# EAGLE design solar_mains_charge_manager (EAGLE 8.4.1)
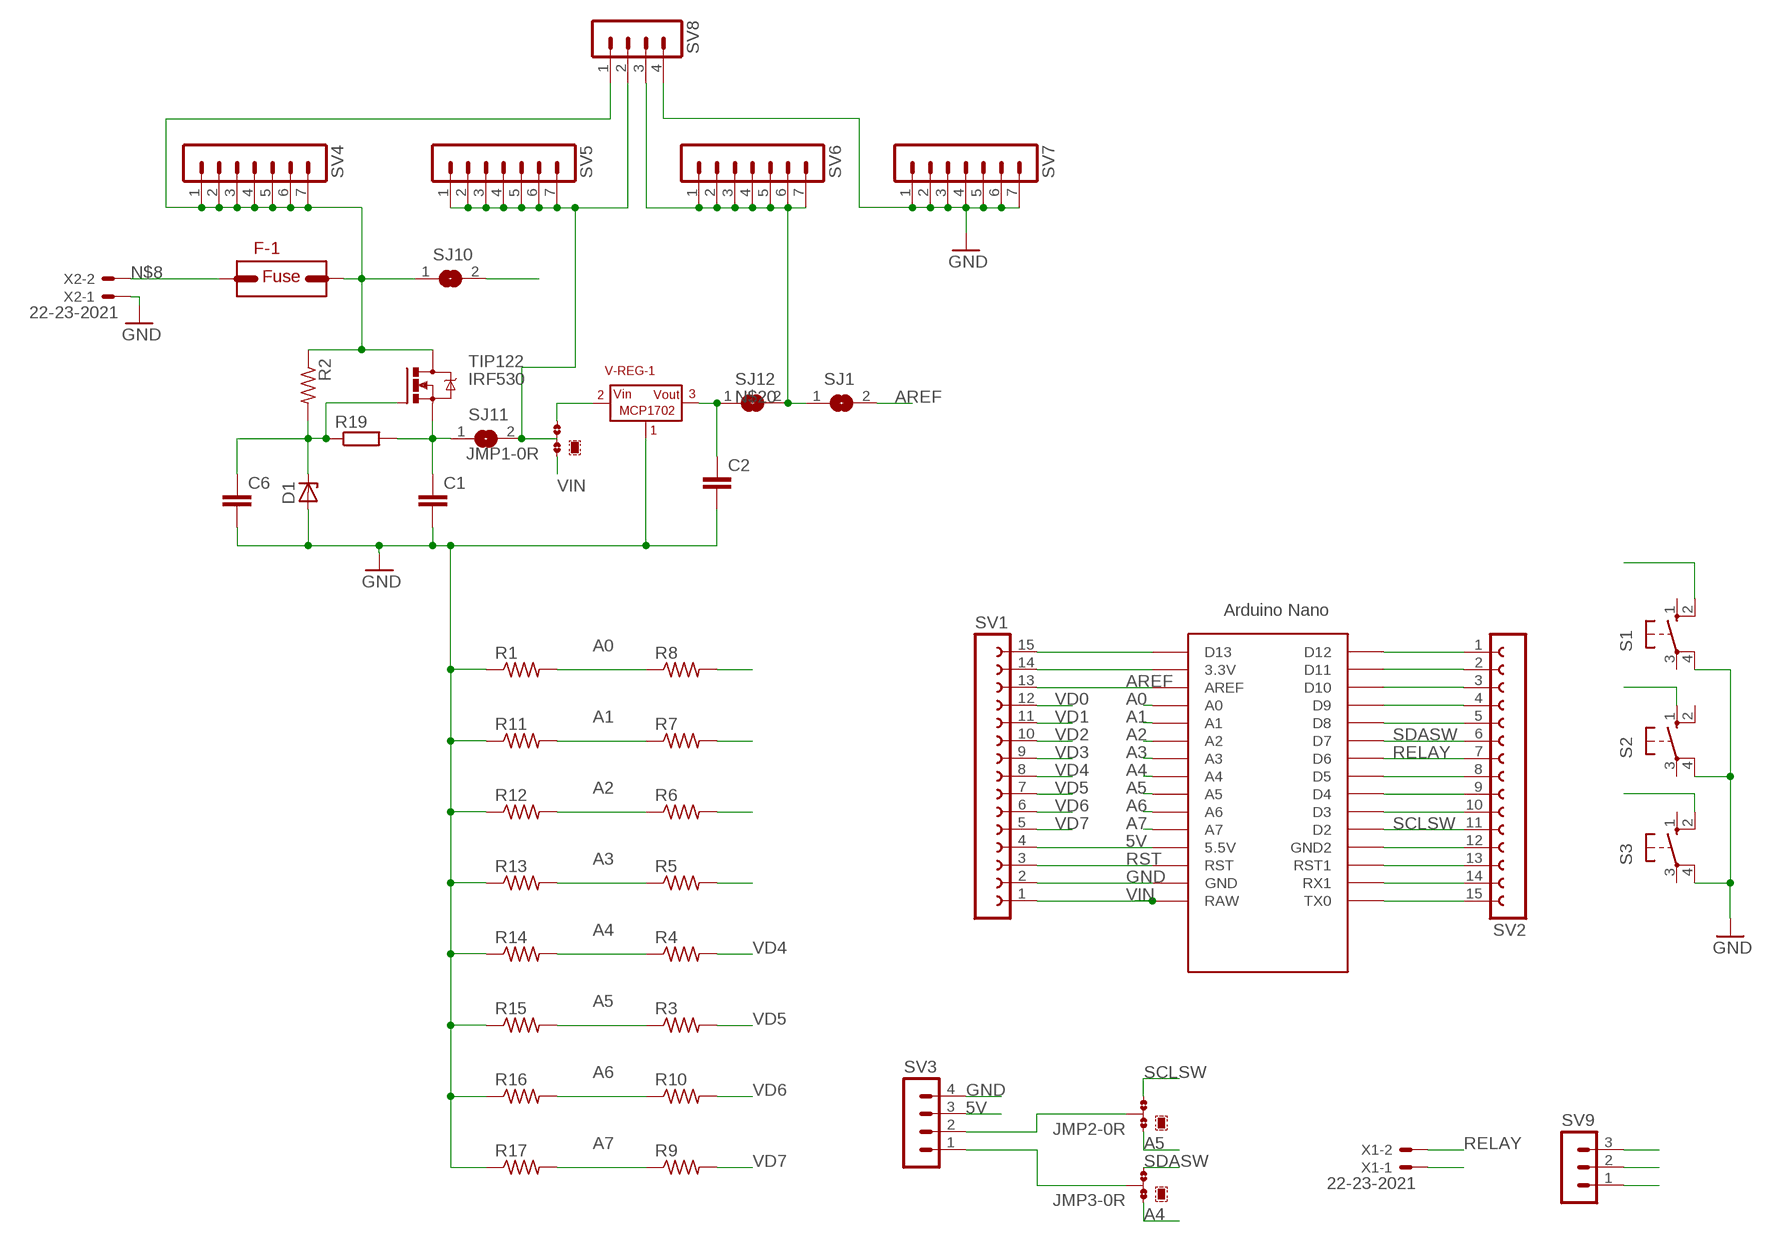
[diagram p0: schematic, sheet 1]

## Parts
C1  C2,5-3  [C2.5-3]
C2  C2,5-3  [C2.5-3]
C6  C2,5-3  [C2.5-3]
D1  ZENER-DIODEDO34-7  [DO34Z7]
F-1  FUSE  [FUSE]
JMP1  0R-JUMPA  [A0R-JMP]
JMP2  0R-JUMPA  [A0R-JMP]
JMP3  0R-JUMPA  [A0R-JMP]
R1  R-US_0204/5  [0204/5]
R2  R-US_0204/2V  [0204V]
R3  R-US_0204/2V  [0204V]
R4  R-US_0204/2V  [0204V]
R5  R-US_0204/2V  [0204V]
R6  R-US_0204/2V  [0204V]
R7  R-US_0204/2V  [0204V]
R8  R-US_0204/2V  [0204V]
R9  R-US_0204/2V  [0204V]
R10  R-US_0204/2V  [0204V]
R11  R-US_0204/5  [0204/5]
R12  R-US_0204/5  [0204/5]
R13  R-US_0204/5  [0204/5]
R14  R-US_0204/5  [0204/5]
R15  R-US_0204/5  [0204/5]
R16  R-US_0204/5  [0204/5]
R17  R-US_0204/5  [0204/5]
R19  R-EU_0204/5  [0204/5]
S1  10-XX  [B3F-10XX]
S2  10-XX  [B3F-10XX]
S3  10-XX  [B3F-10XX]
SJ1  SJ  [SJ]
SJ10  SJ  [SJ]
SJ11  SJ  [SJ]
SJ12  SJ  [SJ]
SV1  FE15-1  [FE15]
SV2  FE15-1  [FE15]
SV3  MA04-1  [MA04-1]
SV4  MA07-1  [MA07-1]
SV5  MA07-1  [MA07-1]
SV6  MA07-1  [MA07-1]
SV7  MA07-1  [MA07-1]
SV8  MA04-1  [MA04-1]
SV9  MA03-1  [MA03-1]
TIP122  IRF530  [TO220BV]
U$1  NANO  [NANO]
V-REG-1  MCP1702  [TO92]
X1  22-23-2021  [22-23-2021]
X2  22-23-2021  [22-23-2021]

## Nets
5V: SJ1.1 SJ12.2 SV1.4 SV3.3 SV6.1 SV6.2 SV6.3 SV6.4 SV6.5 SV6.6 SV6.7 SV8.3 SV9.3 U$1.5V(5.5V)
A0: R1.2 R8.1 U$1.A0
A1: R7.1 R11.2 U$1.A1
A2: R6.1 R12.2 U$1.A2
A3: R5.1 R13.2 U$1.A3
A4: JMP3.1 R4.1 R14.2 U$1.A4
A5: JMP2.1 R3.1 R15.2 U$1.A5
A6: R10.1 R16.2 U$1.A6
A7: R9.1 R17.2 SV9.1 U$1.A7
AREF: SJ1.2 SV1.13 U$1.AREF
BAT: F-1.P$2 R2.1 SJ10.1 SV4.1 SV4.2 SV4.3 SV4.4 SV4.5 SV4.6 SV4.7 SV8.1 TIP122.D
D8: S2.1(S) SV2.5 U$1.D8
D9: S1.2(S1) SV2.4 U$1.D9
GND: C1.2 C2.2 C6.2 D1.A R1.1 R11.1 R12.1 R13.1 R14.1 R15.1 R16.1 R17.1 S1.4(P1) S2.4(P1) S3.4(P1) SV1.2 SV2.12 SV3.4 SV7.1 SV7.2 SV7.3 SV7.4 SV7.5 SV7.6 SV7.7 SV8.4 SV9.2 U$1.GND U$1.GND1(GND2) V-REG-1.1 X1.1 X2.1
N$1: C1.1 R19.2 SJ11.1 TIP122.S
N$2: SV1.15 U$1.D13
N$3: C6.1 D1.C R2.2 R19.1 TIP122.G
N$4: SV2.1 U$1.D12
N$5: SV1.14 U$1.3.3V
N$6: JMP1.3 V-REG-1.2
N$7: SV2.2 U$1.D11
N$8: F-1.P$1 X2.2
N$12: JMP2.2 SV3.2
N$13: JMP3.2 SV3.1
N$18: SV2.3 U$1.D10
N$20: C2.1 SJ12.1 V-REG-1.3
N$21: JMP1.2 SJ11.2 SV5.1 SV5.2 SV5.3 SV5.4 SV5.5 SV5.6 SV5.7 SV8.2
N$24: SV2.8 U$1.D5
N$25: SV2.9 U$1.D4
N$26: SV2.10 U$1.D3
N$29: SV2.13 U$1.RST1
N$30: SV2.14 U$1.RX1
N$31: SV2.15 U$1.TX0
RELAY: SV2.7 U$1.D6 X1.2
RST: S3.2(S1) SV1.3 U$1.RST
SCLSW: JMP2.3 SV2.11 U$1.D2
SDASW: JMP3.3 SV2.6 U$1.D7
VD0: R8.2 SJ10.2 SV1.12
VD1: R7.2 SV1.11
VD2: R6.2 SV1.10
VD3: R5.2 SV1.9
VD4: R4.2 SV1.8
VD5: R3.2 SV1.7
VD6: R10.2 SV1.6
VD7: R9.2 SV1.5
VIN: JMP1.1 SV1.1 U$1.RAW
Unconnected: S1.1(S) S1.3(P) S2.2(S1) S2.3(P) S3.1(S) S3.3(P)

## Library data of the parts
C1 C2 C6 = capacitor-wima:C: CAPACITOR naming: grid - package width
D1 = diode:ZENER-DIODE: Z-Diode
F-1 = qfm-trx1-24g:FUSE: Fuse
JMP1-JMP3 = jump-0r-smd:0R-JUMP: SMD 0R 0805 Jumper
R1 R11-R17 = rcl:R-US_: RESISTOR, American symbol
R2-R10 = resistor:R-US_: RESISTOR, American symbol
R19 = resistor:R-EU_: RESISTOR, European symbol
S1-S3 = switch-omron:10-XX: OMRON SWITCH; MPN: B3F-1000; OC_FARNELL: 176432; OC_NEWARK: 36M3542
SJ1 SJ10-SJ12 = jumper:SJ: SMD solder JUMPER
SV1 SV2 = con-lsta:FE15-1: FEMALE HEADER; OC_FARNELL: unknown; OC_NEWARK: unknown
SV3 SV8 = con-lstb:MA04-1: PIN HEADER; OC_FARNELL: unknown; OC_NEWARK: unknown
SV4-SV7 = con-lstb:MA07-1: PIN HEADER; OC_FARNELL: unknown; OC_NEWARK: unknown
SV9 = con-lstb:MA03-1: PIN HEADER; OC_FARNELL: unknown; OC_NEWARK: unknown
TIP122 = transistor-power:IRF530: HEXFET Power MOSFET
U$1 = nano_without_those_headers:NANO: Arduino Nano without ICP pads (pins still have to be removed) https://www.youtube.com/watch?v=Sri4Kd_5IKo
V-REG-1 = qfm-trx1-24g:MCP1702: Voltage Regulator
X1 X2 = con-molex:22-23-2021: .100" (2.54mm) Center Header - 2 Pin; MF: MOLEX; MPN: 22-23-2021; OC_FARNELL: 1462926; OC_NEWARK: 25C3832

## Board
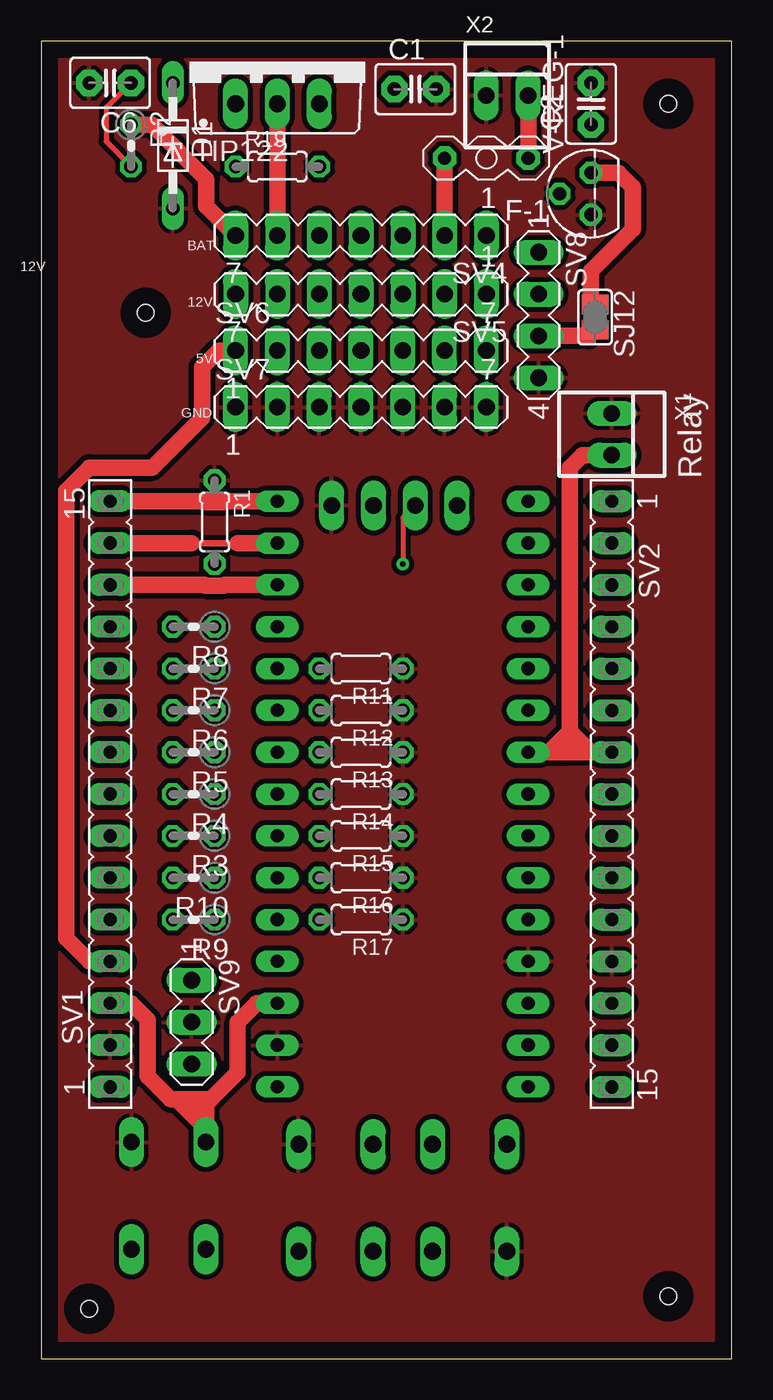
[diagram p1: board, top side]
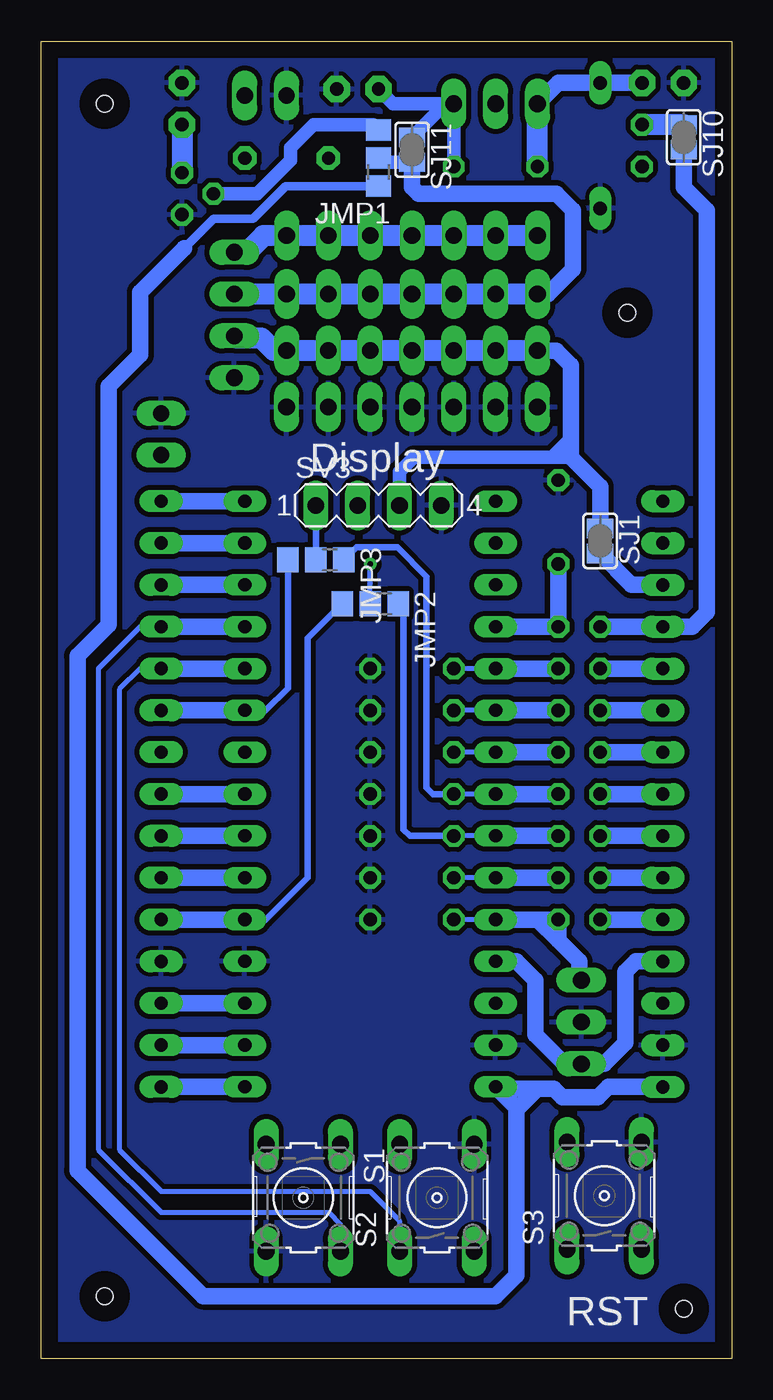
[diagram p2: board, bottom side, seen from below]

Size 41.96 x 80 mm. Coordinates in mm from the lower left corner, seen from the top.
Outline: 0,0 41.96,0 41.96,80 0,80 0,0
Copper layers (1*16): Top 0.035mm / dielectric 1.5mm / Bottom 0.035mm
Design rules "default": minimum track width 6mil, minimum drill 0.35mm, track to track 6mil, track to pad 6mil, pad to pad 6mil, via to via 6mil, smd to smd 6mil, copper to edge 40mil, drill to drill 6mil, minimum pad ring 10mil, minimum via ring 8mil, stop-mask expansion 4mil, vias tented up to drill 0mil, thermal gap 10mil
Holes 1 mm at 6.35,63.5 38.1,76.2 38.1,3.81 2.92,3.05

### Footprints (pad centres in the part's own frame; a part is rotated, then mirrored left to right if it is on the bottom)
C2.5-3 = drill 0.813 pad 1.6 octagon: 1 -1.27,0; 2 1.27,0
DO34Z7 = drill 0.813 long: A 3.81,0; C -3.81,0
FUSE = drill 0.8 pad 1.422 octagon: P$1 -2.54,0; P$2 2.54,0
A0R-JMP = smd 1.5 x 1.3: 1 0,1.7; 2 0,0; 3 0,-1.7
0204/5 = drill 0.813 octagon: 1 -2.54,0; 2 2.54,0
0204V = drill 0.813 octagon: 1 -1.27,0; 2 1.27,0
B3F-10XX = drill 1.016 long: 1 -3.251,2.261; 2 3.251,2.261; 3 -3.251,-2.261; 4 3.251,-2.261
SJ = smd 1.168 x 1.6: 1 -0.762,0; 2 0.762,0
FE15 = drill 0.813 long: 1 -17.78,0; 2 -15.24,0; 3 -12.7,0; 4 -10.16,0; 5 -7.62,0; 6 -5.08,0; 7 -2.54,0; 8 0,0; 9 2.54,0; 10 5.08,0; 11 7.62,0; 12 10.16,0; 13 12.7,0; 14 15.24,0; 15 17.78,0
MA04-1 = drill 1.016 long: 1 -3.81,0; 2 -1.27,0; 3 1.27,0; 4 3.81,0
MA07-1 = drill 1.016 long: 1 -7.62,0; 2 -5.08,0; 3 -2.54,0; 4 0,0; 5 2.54,0; 6 5.08,0; 7 7.62,0
MA03-1 = drill 1.016 long: 1 -2.54,0; 2 0,0; 3 2.54,0
TO220BV = drill 1.016 long: D 0,-2.54; G -2.54,-2.54; S 2.54,-2.54
NANO = drill 0.8 long: 3.3V -10.16,24.13; 5V -10.16,-1.27; A0 -10.16,19.05; A1 -10.16,16.51; A2 -10.16,13.97; A3 -10.16,11.43; A4 -10.16,8.89; A5 -10.16,6.35; A6 -10.16,3.81; A7 -10.16,1.27; AREF -10.16,21.59; D2 5.08,1.27; D3 5.08,3.81; D4 5.08,6.35; D5 5.08,8.89; D6 5.08,11.43; D7 5.08,13.97; D8 5.08,16.51; D9 5.08,19.05; D10 5.08,21.59; D11 5.08,24.13; D12 5.08,26.67; D13 -10.16,26.67; GND -10.16,-6.35; GND1 5.08,-1.27; RAW -10.16,-8.89; RST -10.16,-3.81; RST1 5.08,-3.81; RX1 5.08,-6.35; TX0 5.08,-8.89
TO92 = drill 0.813 octagon: 1 -1.27,0; 2 0,1.905; 3 1.27,0
22-23-2021 = drill 1 long: 1 -1.27,0; 2 1.27,0

### Placement (x,y rotation side)
C1  22.73,77.09 0 top
C2  33.4,76.2 90 top
C6  4.19,77.47 180 top
D1  8,73.66 270 top
F-1  27.05,72.9 180 top
JMP1  21.46,72.9 180 bottom
JMP2  21.97,45.85 270 bottom
JMP3  25.27,48.51 270 bottom
R1  10.54,50.8 270 top
R2  5.46,73.66 270 top
R3  9.27,31.75 180 top
R4  9.27,34.29 180 top
R5  9.27,36.83 180 top
R6  9.27,39.37 180 top
R7  9.27,41.91 180 top
R8  9.27,44.45 180 top
R9  9.27,26.67 180 top
R10  9.27,29.21 180 top
R11  19.43,41.91 180 top
R12  19.43,39.37 180 top
R13  19.43,36.83 180 top
R14  19.43,34.29 180 top
R15  19.43,31.75 180 top
R16  19.43,29.21 180 top
R17  19.43,26.67 180 top
R19  14.35,72.39 0 top
S1  26.04,9.78 270 bottom
S2  17.91,9.78 90 bottom
S3  7.75,9.91 90 bottom
SJ1  8,49.66 270 bottom
SJ10  2.92,74.17 270 bottom
SJ11  19.43,73.41 270 bottom
SJ12  33.66,63.25 270 top
SV1  4.19,34.29 90 top
SV2  34.67,34.29 270 top
SV3  21.46,51.82 0 bottom
SV4  19.43,68.2 180 top
SV5  19.43,64.64 180 top
SV6  19.43,61.21 0 top
SV7  19.43,57.78 0 top
SV8  30.23,63.37 270 top
SV9  9.14,20.45 270 top
TIP122  14.35,78.74 0 top
U$1  24.51,25.4 0 top
V-REG-1  33.4,70.74 90 top
X1  34.67,56.13 270 top
X2  28.32,76.71 0 top

### Tracks (layer width: path | path; a pad name or v marks a point on that pad's centre or on a via)
5V
  Top 1.016: SJ12.2 33.27,62.1 SV8.3 | SV6.1 10.79,61.21 9.78,60.2 9.78,57.15 6.73,54.1 2.92,54.1 1.52,52.7 1.52,25.53 2.92,24.13 SV1.4
  Bottom 0.406: 11.05,54.74 10.54,54.74 | 10.54,54.74 9.78,54.74 | 10.54,54.74 9.78,55.5 9.78,55.88
  Bottom 0.813: 9.78,54.74 10.92,54.74 | SV3.3 20.19,53.85 19.3,54.74 11.05,54.74 10.92,54.74 | 9.78,55.88 10.92,54.74
  Bottom 1.016: U$1.5V 13.08,24.13 11.94,22.99 11.94,19.68 10.16,17.91 SV9.3 7.75,17.91 6.48,19.18 6.48,23.5 5.84,24.13 SV1.4 | SV6.1 10.67,61.21 9.78,60.33 9.78,55.88 9.78,54.74 8,52.96 SJ1.1
  Bottom 1.27: 29.46,62.1 SV8.3 30.1,61.98 28.57,61.98 27.81,61.21 SV6.7 SV6.6 SV6.5 SV6.4 SV6.3 SV6.2 SV6.1 12.06,60.96
A0
  Bottom 1.016: U$1.A0 R8.1 R1.2
A1
  Bottom 0.305: U$1.A1 R11.2
  Bottom 1.016: R7.1 U$1.A1
A2
  Bottom 0.305: U$1.A2 R12.2
  Bottom 1.016: R6.1 U$1.A2
A3
  Bottom 0.305: U$1.A3 R13.2
  Bottom 1.016: R5.1 U$1.A3
A4
  Bottom 0.305: U$1.A4 R14.2
  Bottom 0.406: R14.2 18.16,34.29 18.54,34.67 18.54,47.5 20.32,49.28 22.81,49.28 JMP3.1
  Bottom 1.016: R4.1 U$1.A4
A5
  Bottom 0.305: U$1.A5 R15.2
  Bottom 0.406: R15.2 19.56,31.75 19.94,32.13 19.94,45.52 JMP2.1
  Bottom 1.016: R3.1 U$1.A5
A6
  Bottom 0.305: U$1.A6 R16.2
  Bottom 1.016: R10.1 U$1.A6
A7
  Bottom 0.305: U$1.A7 R17.2
  Bottom 1.016: 11.81,26.67 U$1.A7 | 11.81,26.67 R9.1 10.54,25.4 | 11.81,26.67 10.54,25.4 | SV9.1 9.27,23.11 9.27,24.13 10.54,25.4
AREF
  Top 1.016: SV1.13 9.94,46.99 9.99,46.94 11.09,46.94 11.14,46.99 U$1.AREF
  Bottom 1.016: SJ1.2 6.1,46.99 SV1.13
BAT
  Top 1.016: SV4.6 TIP122.D | SV4.7 10.03,69.98 10.03,71.63 6.73,74.93 R2.1 | F-1.P$2 SV4.2
  Bottom 1.27: SV8.1 29.46,67.18 28.45,68.2 SV4.1 SV4.2 | 24.51,67.31 SV4.2 | SJ10.1 R2.1 | SV4.7 SV4.6 SV4.5 SV4.4 SV4.3 SV4.2
D8
  Bottom 0.305: SV2.5 35.94,41.91 37.21,40.64 37.21,12.7 34.67,10.16 21.97,10.16 20.19,8.38 20.19,8.13 20.17,8.1 S2.1
  Bottom 1.016: SV2.5 U$1.D8
D9
  Bottom 0.305: SV2.4 35.94,44.45 38.48,41.91 38.48,12.7 34.67,8.89 24.51,8.89 23.77,8.15 S1.2
  Bottom 1.016: U$1.D9 SV2.4
GND
  pour Bottom (isolate 0.305): -2.16,80.01 118.49,80.01 118.49,-11.43 -2.16,-11.43
  pour Top (isolate 0.305): -0.89,80.01 100.71,80.01 100.71,0 -0.89,0
N$1
  Bottom 0.305: 21.27,76.9 C1.1
  Bottom 0.813: R19.2 TIP122.S | TIP122.S 17.4,76.2 SJ11.1 | TIP122.S 20.57,76.2 21.27,76.9
N$2
  Top 1.016: SV1.15 9.94,52.07 9.99,52.02 11.09,52.02 11.14,52.07 U$1.D13
N$3
  Top 0.305: R2.2 3.94,73.91 3.94,75.95 C6.1
  Bottom 1.016: C6.1 D1.C 10.54,77.47 TIP122.G
  Bottom 1.27: R19.1 TIP122.G
N$4
  Bottom 1.016: U$1.D12 SV2.1
N$5
  Top 0.406: 9.14,49.53 11.94,49.53
  Top 1.016: SV1.14 9.14,49.53 | 11.94,49.53 U$1.3.3V
N$6
  Bottom 0.813: JMP1.3 21.8,74.93 25.4,74.93 26.8,73.53 26.8,72.77 28.83,70.74 V-REG-1.2
N$7
  Bottom 1.016: SV2.2 U$1.D11
N$8
  Top 1.016: F-1.P$1 X2.2
N$12  (via drill 0.35)
  Top 0.305: SV3.2 21.97,51.05 v21.97,48.26
  Bottom 0.305: 21.97,47.12 v21.97,48.26 | 21.97,47.12 21.99,47.1 21.99,46.99 | JMP2.2 21.97,47.12
N$13
  Bottom 0.406: JMP3.2 SV3.1
N$18
  Bottom 1.016: U$1.D10 SV2.3
N$20
  Top 1.016: V-REG-1.3 35.05,72.01 35.94,71.12 35.94,68.58 33.4,66.04 33.4,64.26 SJ12.1
  Bottom 1.27: C2.1 V-REG-1.3
N$21
  Bottom 0.813: SJ11.2 21.21,72.64 JMP1.2
  Bottom 1.016: SJ11.2 19.43,71.12 19.05,70.74 10.67,70.74 9.65,69.72 9.65,66.17 11.18,64.64 SV5.7
  Bottom 1.27: SV8.2 SV5.1 SV5.2 SV5.3 SV5.4 SV5.5 SV5.6 SV5.7
N$24
  Bottom 1.016: U$1.D5 SV2.8
N$25
  Bottom 1.016: SV2.9 U$1.D4
N$26
  Bottom 1.016: U$1.D3 SV2.10
N$29
  Bottom 1.016: U$1.RST1 SV2.13
N$30
  Bottom 1.016: SV2.14 U$1.RX1
N$31
  Bottom 1.016: SV2.15 U$1.TX0
RELAY
  Top 1.016: 33.4,36.83 SV2.7 | 33.4,36.83 32.13,36.83 | 30.86,36.83 32.13,36.83 | 30.86,36.83 U$1.D6 | 32.13,36.83 32.13,38.1 | 32.13,38.1 30.86,36.83 | 32.13,38.1 33.4,36.83 | X1.2 32.89,54.86 32.13,54.1 32.13,38.1
RST
  Top 1.016: 10.29,15.75 9.27,15.75 | 8.23,15.75 9.27,15.75 | 10.29,15.75 11.94,17.4 11.94,20.45 13.08,21.59 U$1.RST | 10.01,15.01 10.01,15.47 10.29,15.75 | 10.01,13.97 8.23,15.75 | 8.23,15.75 7.87,15.75 6.48,17.14 6.48,20.57 5.46,21.59 SV1.3 | 10.01,13.97 10.01,15.01 | S3.2 10.01,13.97 | 10.01,15.01 9.27,15.75
SCLSW
  Bottom 0.305: 29.54,26.72 U$1.D2
  Bottom 0.406: JMP2.3 25.78,43.74 25.78,29.21 28.32,26.67 U$1.D2
  Bottom 1.016: U$1.D2 SV2.11
SDASW
  Bottom 0.305: 29.54,39.42 U$1.D7
  Bottom 0.406: JMP3.3 26.97,40.72 28.32,39.37 U$1.D7
  Bottom 1.016: U$1.D7 SV2.6
VD0
  Bottom 1.016: R8.2 SV1.12 2.41,44.45 1.52,45.34 1.52,69.72 2.92,71.12 SJ10.2
VD1
  Bottom 1.016: R7.2 SV1.11
VD2
  Bottom 1.016: SV1.10 R6.2
VD3
  Bottom 1.016: R5.2 SV1.9
VD4
  Bottom 1.016: SV1.8 R4.2
VD5
  Bottom 1.016: SV1.7 R3.2
VD6
  Bottom 1.016: SV1.6 R10.2
VD7
  Bottom 1.016: SV1.5 R9.2
VIN
  Bottom 0.508: JMP1.1 27.1,71.2 29.08,69.22 31.5,69.22 33.27,67.44
  Bottom 1.016: 11.81,16.38 14.22,16.38 U$1.RAW 13.08,15.24 | 11.81,16.38 10.79,16.38 10.29,15.88 8.13,15.88 7.49,16.51 SV1.1 | 33.27,67.44 35.94,64.77 35.94,60.96 37.85,59.05 37.85,44.58 39.75,42.67 39.75,11.43 32.13,3.81 14.35,3.81 13.08,5.08 13.08,15.24 | 11.81,16.38 12.95,15.24 13.08,15.24

### Text on the board
tPlace: BAT | 12V | 12V | 5V | GND | Relay
bPlace: Display | RST